# Altium project HIL_RIG_Hardware.PrjPcb (part 11 of 11)

## Sheet  Led_Green_Direct.SchDoc
size A4; SheetNumber: 4; SheetTotal: 29
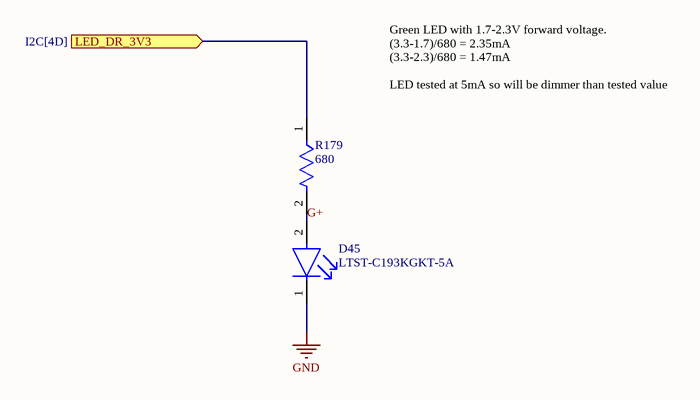
[diagram p28:  Led_Green_Direct.SchDoc]

### Parts
D45  LTST-C193KGKT-5A  [FP-LTST-C193KGKT-5A-MFG]
R179  value 680  [FP-CRCW0603-e3-IPC_C]  (hidden comment: CRCW0603680RJNEA)

### Ports
LED_DR_3V3 (in, see I2C[4D])

### Nets
GND: D45.1(C)
G+: D45.2(A) R179.2
NetR179_1: R179.1 ; port LED_DR_3V3

### Notes on the sheet
- Green LED with 1.7-2.3V forward voltage.
  (3.3-1.7)/680 = 2.35mA
  (3.3-2.3)/680 = 1.47mA
  LED tested at 5mA so will be dimmer than tested value

### Library data of the parts
D45 = CMP-007-00038-1: LED yellow green 0603 wavelength 567.5~576.5nm light intensity 4.5~28mcd Front Mounting; Luminous Intensity: 16.25mcd; Viewing Angle: 130°; Number of Circuits: 1; Power Dissipation: 50mW; Peak Wavelength: 574nm; Illumination Color: Green, Yellow; Lens Color: Clear, Colorless; Lens Style: Clear, Colorless, Diffused, Rectangular; Forward Voltage: 1.9V; Power Rating: 75mW; Reverse Voltage: 5V; Wavelength: 571nm; Shape: Rectangular; Lens Transparency: Clear; Test Current: 5mA; Forward Current: 30mA; Width: 800µm; Manufacturer Package Identifier: LTST-C193KGKT-5A; Dominant Wavelength: 576.5nm; Export Control Classification Number (ECCN) Code: EAR99; Color: Green; Lead Free: Lead Free; Introduction Date: 2007-03-15; RoHS: Compliant; Number of Elements: 1; Height: 350µm; Schedule B: 8541402000, 8541402000; Country of Origin: Mainland China, Thailand; Case Code (Imperial): 0603; Length: 1.6mm; Lifecycle Status: Production; China RoHS: Compliant; Min Operating Temperature: -55°C; Terminal Pitch: 1.5mm; Number of LEDs: 1; Number of Terminals: 2; Pins: 2; Case Code (Metric): 1608; Max Operating Temperature: 85°C; Harmonized Tariff Schedule (HTS) Code: 8541.40.20.00; Depth: 800µm; Mounting Technology: Surface Mount; Case/Package: 0603; REACH SVHC: Yes; Radiation Hardening: No
R179 = CMP-009-00300-1: as R149 on sheet  3V3_High_Current; Case/Package: 0603; Voltage Rating (DC): 75V; Lifecycle Status: Production; Depth: 850µm; Introduction Date: 2005-02-16; Number of Terminations: 2; Composition: Thick Film; Export Control Classification Number (ECCN) Code: EAR99; RoHS: Compliant; Packaging: Cut Tape; Max Power Dissipation: 100mW; Max Operating Temperature: 155°C; Harmonized Tariff Schedule (HTS) Code: 8533.21.00.30; Voltage Rating: 75V; China RoHS: Non-Compliant; Width: 850µm; Height: 450µm; Schedule B: 8533210045, 8533210045; Mounting Technology: Surface Mount; Pins: 2; Radiation Hardening: No; Features: Automotive AEC-Q200; Min Operating Temperature: -55°C; Lead Free: Lead Free; Working Voltage: 75V; Military Standard: Not; Tolerance: 5%; Case Code (Imperial): 0603; Number of Terminals: 2; Weight: 2.012816mg; REACH SVHC: Yes; Length: 1.55mm; Ratings: AEC-Q200; Contact Plating: Tin; Termination: SMD/SMT; Country of Origin: Israel, Taiwan

## Sheet  LED_Orange_Direct.SchDoc
size A4; SheetNumber: 10; SheetTotal: 29
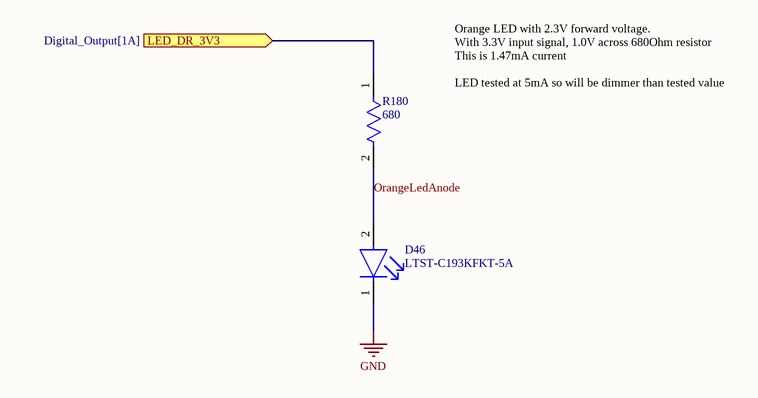
[diagram p29:  LED_Orange_Direct.SchDoc]

### Parts
D46  LTST-C193KFKT-5A  [FP-LTST-C193KGKT-5A-MFG]
R180  value 680  [FP-CRCW0603-e3-IPC_C]  (hidden comment: CRCW0603680RJNEA)

### Ports
LED_DR_3V3 (in, see Digital_Output[1A])

### Nets
GND: D46.1(C)
OrangeLedAnode: D46.2(A) R180.2
NetR180_1: R180.1 ; port LED_DR_3V3

### Notes on the sheet
- Orange LED with 2.3V forward voltage.
  With 3.3V input signal, 1.0V across 680Ohm resistor
  This is 1.47mA current
  LED tested at 5mA so will be dimmer than tested value

### Library data of the parts
D46 = CMP-007-00037-1: LED orange LED0603 wavelength 605nm light intensity 11~45mcd vertical sticker; Lens Color: Clear, Colorless; Number of LEDs: 1; Lens Transparency: Clear; Test Current: 5mA; Lens Style: Colorless, Diffused, Rectangular; Shape: Rectangular; Peak Wavelength: 611nm; Luminous Intensity: 28.1mcd; Forward Current: 30mA; Power Rating: 75mW; Illumination Color: Yellow; Viewing Angle: 130°; Forward Voltage: 2.3V; Reverse Voltage: 5V; Width: 800µm; Number of Circuits: 1; Case Code (Metric): 1608; Height: 350µm; Terminal Pitch: 1.5mm; Lifecycle Status: Production; Case/Package: 0603; Contact Plating: Tin; Number of Terminals: 2; Wavelength: 605nm; REACH SVHC: Yes; RoHS: Compliant; Introduction Date: 2010-10-11; Pins: 2; Packaging: Tape and Reel; Color: Orange; Radiation Hardening: No; Schedule B: 8541402000, 8541402000; Max Operating Temperature: 85°C; Number of Elements: 1; Length: 1.6mm; Power Dissipation: 75mW; Mounting Technology: Surface Mount; Harmonized Tariff Schedule (HTS) Code: 8541.40.20.00; Dominant Wavelength: 605nm; Case Code (Imperial): 0603; Depth: 800µm; China RoHS: Compliant; Min Operating Temperature: -30°C
R180 = CMP-009-00300-1: as R149 on sheet  3V3_High_Current; Case/Package: 0603; Voltage Rating (DC): 75V; Lifecycle Status: Production; Depth: 850µm; Introduction Date: 2005-02-16; Number of Terminations: 2; Composition: Thick Film; Export Control Classification Number (ECCN) Code: EAR99; RoHS: Compliant; Packaging: Cut Tape; Max Power Dissipation: 100mW; Max Operating Temperature: 155°C; Harmonized Tariff Schedule (HTS) Code: 8533.21.00.30; Voltage Rating: 75V; China RoHS: Non-Compliant; Width: 850µm; Height: 450µm; Schedule B: 8533210045, 8533210045; Mounting Technology: Surface Mount; Pins: 2; Radiation Hardening: No; Features: Automotive AEC-Q200; Min Operating Temperature: -55°C; Lead Free: Lead Free; Working Voltage: 75V; Military Standard: Not; Tolerance: 5%; Case Code (Imperial): 0603; Number of Terminals: 2; Weight: 2.012816mg; REACH SVHC: Yes; Length: 1.55mm; Ratings: AEC-Q200; Contact Plating: Tin; Termination: SMD/SMT; Country of Origin: Israel, Taiwan

## Sheet  LED_Green_Direct_ActiveLow.SchDoc
size A4; SheetNumber: 18; SheetTotal: 29
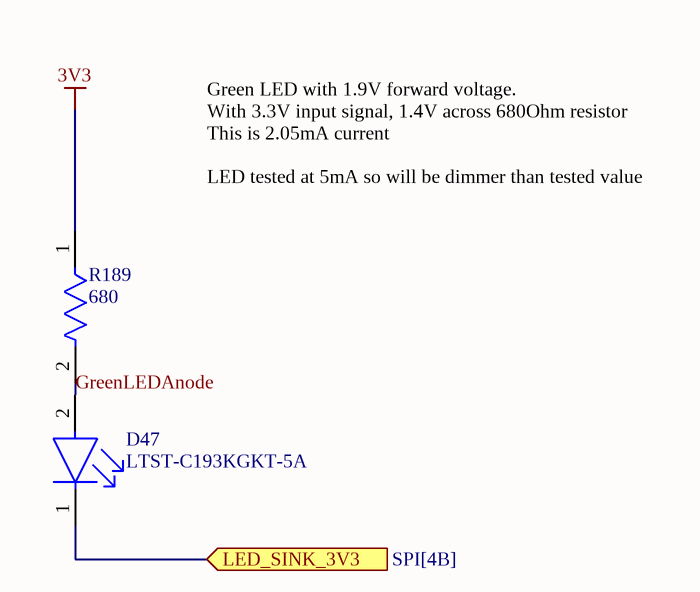
[diagram p30:  LED_Green_Direct_ActiveLow.SchDoc]

### Parts
D47  LTST-C193KGKT-5A  [FP-LTST-C193KGKT-5A-MFG]
R189  value 680  [FP-CRCW0603-e3-IPC_C]  (hidden comment: CRCW0603680RJNEA)

### Ports
LED_SINK_3V3 (in, see SPI[4B])

### Nets
3V3: R189.1
GreenLEDAnode: D47.2(A) R189.2
NetD47_1: D47.1(C) ; port LED_SINK_3V3

### Notes on the sheet
- Green LED with 1.9V forward voltage.
  With 3.3V input signal, 1.4V across 680Ohm resistor
  This is 2.05mA current
  LED tested at 5mA so will be dimmer than tested value

### Library data of the parts
D47 = CMP-007-00038-1: as D45 on sheet  Led_Green_Direct; Width: 800µm; Manufacturer Package Identifier: LTST-C193KGKT-5A; Dominant Wavelength: 576.5nm; Export Control Classification Number (ECCN) Code: EAR99; Color: Green; Lead Free: Lead Free; Introduction Date: 2007-03-15; RoHS: Compliant; Number of Elements: 1; Height: 350µm; Schedule B: 8541402000, 8541402000; Country of Origin: Mainland China, Thailand; Case Code (Imperial): 0603; Length: 1.6mm; Lifecycle Status: Production; China RoHS: Compliant; Min Operating Temperature: -55°C; Terminal Pitch: 1.5mm; Number of LEDs: 1; Number of Terminals: 2; Pins: 2; Case Code (Metric): 1608; Max Operating Temperature: 85°C; Harmonized Tariff Schedule (HTS) Code: 8541.40.20.00; Depth: 800µm; Mounting Technology: Surface Mount; Case/Package: 0603; REACH SVHC: Yes; Radiation Hardening: No
R189 = CMP-009-00300-1: as R149 on sheet  3V3_High_Current; Case/Package: 0603; Voltage Rating (DC): 75V; Lifecycle Status: Production; Depth: 850µm; Introduction Date: 2005-02-16; Number of Terminations: 2; Composition: Thick Film; Export Control Classification Number (ECCN) Code: EAR99; RoHS: Compliant; Packaging: Cut Tape; Max Power Dissipation: 100mW; Max Operating Temperature: 155°C; Harmonized Tariff Schedule (HTS) Code: 8533.21.00.30; Voltage Rating: 75V; China RoHS: Non-Compliant; Width: 850µm; Height: 450µm; Schedule B: 8533210045, 8533210045; Mounting Technology: Surface Mount; Pins: 2; Radiation Hardening: No; Features: Automotive AEC-Q200; Min Operating Temperature: -55°C; Lead Free: Lead Free; Working Voltage: 75V; Military Standard: Not; Tolerance: 5%; Case Code (Imperial): 0603; Number of Terminals: 2; Weight: 2.012816mg; REACH SVHC: Yes; Length: 1.55mm; Ratings: AEC-Q200; Contact Plating: Tin; Termination: SMD/SMT; Country of Origin: Israel, Taiwan

## Sheet  LED_RED_Direct_BRIGHT.SchDoc
size A4; SheetNumber: 5; SheetTotal: 29
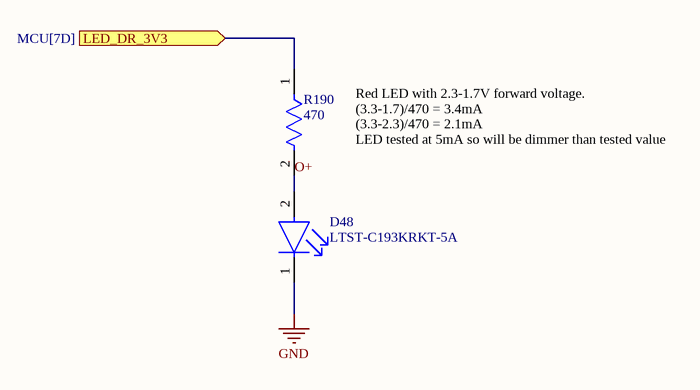
[diagram p31:  LED_RED_Direct_BRIGHT.SchDoc]

### Parts
D48  LTST-C193KRKT-5A  [FP-LTST-C193KRKT-5A-MFG]
R190  value 470  [FP-CRGCQ0603-IPC_A]  (hidden comment: CRGCQ0603J470R)

### Ports
LED_DR_3V3 (in, see MCU[7D])

### Nets
GND: D48.1(C)
O+: D48.2(A) R190.2
NetR190_1: R190.1 ; port LED_DR_3V3

### Notes on the sheet
- Red LED with 2.3-1.7V forward voltage.
  (3.3-1.7)/470 = 3.4mA
  (3.3-2.3)/470 = 2.1mA
  LED tested at 5mA so will be dimmer than tested value

### Library data of the parts
D48 = CMP-007-00039-1: Single-color LEDs; LITEON; LTST-C193KRKT-5A; Red; 130 °; 2.3 V; 0603; Viewing Angle: 130°; Lens Transparency: Clear; Test Current: 5mA; Power Dissipation: 50mW; Forward Voltage: 2.3V; Wavelength: 631nm; Lens Color: Clear, Colorless; Luminous Intensity: 26.05mcd; Number of LEDs: 1; Shape: Rectangular; Lens Style: Clear, Colorless, Diffused, Rectangular; Forward Current: 20mA; Reverse Voltage: 5V; Peak Wavelength: 639nm; RoHS: Compliant; Length: 1.6mm; Pins: 2; Lifecycle Status: Production; Harmonized Tariff Schedule (HTS) Code: 8541.40.20.00; Height: 350µm; Case Code (Imperial): 0603; Country of Origin: Mainland China, Thailand; Width: 800µm; Mounting Technology: Surface Mount; REACH SVHC: Yes; Lead Free: Lead Free; Export Control Classification Number (ECCN) Code: EAR99; Radiation Hardening: No; Case/Package: 0603; Depth: 800µm; Dominant Wavelength: 631nm; Illumination Color: Red; Min Operating Temperature: -30°C; Introduction Date: 2008-09-01; Number of Elements: 1; Number of Terminals: 2; Number of Circuits: 1; Schedule B: 8541402000, 8541402000; Case Code (Metric): 1608; Max Operating Temperature: 85°C; Color: Red; Terminal Pitch: 1.5mm; China RoHS: Compliant
R190 = CMP-009-00304-1: Res Thick Film 0603 470 Ohm 5% 0.1W(1/10W) ±100ppm/°C Pad SMD T/R Automotive AEC-Q200; Manufacturer Lifecycle Status: ACTIVE; Working Voltage: 75V; Power Rating: 100mW; RoHS: Compliant; Lifecycle Status: Production; Voltage Rating: 75V; Number of Terminals: 2; Packaging: Cut Tape; Width: 800µm; Height: 450µm; Min Operating Temperature: -55°C; Introduction Date: 2019-08-26; Ambient Temperature Range High: 70°C; Voltage Rating (DC): 75V; Max Operating Temperature: 155°C; China RoHS: Non-Compliant; Operating Supply Voltage: 75V; Schedule B: 8533210025, 8533210025; Tolerance: 5%; REACH SVHC: Yes; Ratings: AEC-Q200; Harmonized Tariff Schedule (HTS) Code: 8533.21.00.30; Mounting Technology: Surface Mount; Composition: Thick Film; Temperature Coefficient: 100ppm/°C; Case/Package: 0603; Export Control Classification Number (ECCN) Code: EAR99; Length: 1.6mm

## Sheet  LED_Blue_Direct_BRIGHT.SchDoc
size A4; SheetNumber: 6; SheetTotal: 29
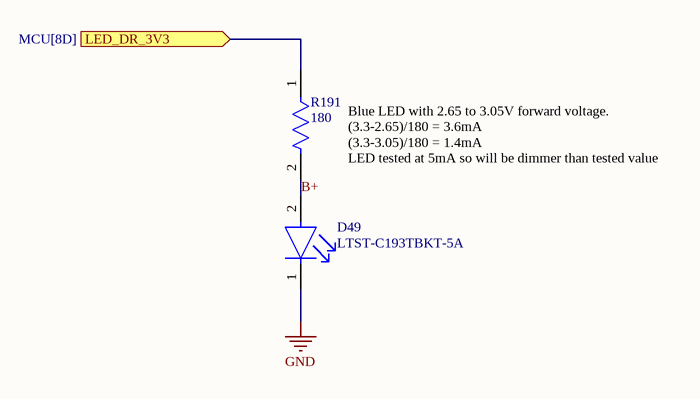
[diagram p32:  LED_Blue_Direct_BRIGHT.SchDoc]

### Parts
D49  LTST-C193TBKT-5A  [FP-LTST-C193TBKT-5A-MFG]
R191  value 180  [FP-RT0603-IPC_C]  (hidden comment: RT0603DRE07180RL)

### Ports
LED_DR_3V3 (in, see MCU[8D])

### Nets
GND: D49.1(C)
B+: D49.2(A) R191.2
NetR191_1: R191.1 ; port LED_DR_3V3

### Notes on the sheet
- Blue LED with 2.65 to 3.05V forward voltage.
  (3.3-2.65)/180 = 3.6mA
  (3.3-3.05)/180 = 1.4mA
  LED tested at 5mA so will be dimmer than tested value

### Library data of the parts
D49 = CMP-007-00045-1: LED blue 0603 wavelength 465~475nm light intensity 15mcd Front Mounting; Forward Current: 20mA; Viewing Angle: 130°; Lens Color: Clear, Colorless; Peak Wavelength: 468nm; Forward Voltage: 2.8V; Number of Elements: 1; Lens Style: Clear, Colorless, Diffused, Rectangular; Shape: Rectangular; Dominant Wavelength: 475nm; Test Current: 5mA; Wavelength: 470nm; Lens Transparency: Clear; Reverse Voltage: 5V; Power Dissipation: 76mW; Mounting Technology: Surface Mount; Lifecycle Status: Production; Pins: 2; Schedule B: 8541402000, 8541402000; RoHS: Compliant; REACH SVHC: Yes; Number of LEDs: 1; Width: 800µm; Luminous Intensity: 15mcd; Radiation Hardening: No; Case Code (Imperial): 0603; Length: 1.6mm; Case Code (Metric): 1608; Terminal Pitch: 1.5mm; Lead Free: Lead Free; Min Operating Temperature: -20°C; Color: Blue; Case/Package: 0603; Number of Terminals: 2; China RoHS: Compliant; Max Operating Temperature: 80°C; Contact Plating: Tin; Height: 350µm; Number of Circuits: 1; Illumination Color: Blue; Depth: 800µm
R191 = CMP-009-00324-1: Res Thin Film 0603 180 Ohm 0.5% 0.1W(1/10W) ±50ppm/C Pad SMD T/R; Power Rating: 100mW; Voltage Rating (DC): 50V; Voltage Rating: 75V; Temperature Coefficient: 50ppm/°C; Composition: Thin Film; Case/Package: 0603; Mounting Technology: Surface Mount; Harmonized Tariff Schedule (HTS) Code: 8533.21.00.30; REACH SVHC: Yes; Max Operating Temperature: 155°C; Tolerance: 0.5%; Min Operating Temperature: -55°C; Height: 450µm; RoHS: Compliant; Working Voltage: 75V; Number of Terminals: 2; China RoHS: Non-Compliant; Export Control Classification Number (ECCN) Code: EAR99; Introduction Date: 2008-07-11; Packaging: Tape & Reel (TR); Lifecycle Status: Production; Schedule B: 8533210045; Width: 800µm; Length: 1.6mm; Case Code (Imperial): 0603; Country of Origin: Mainland China, Taiwan; Features: Moisture Resistant; Lead Free: Lead Free; Max Power Dissipation: 100mW; Number of Terminations: 2

## Nets that join several sheets
3V3:  MCU (8 pins),  Digital_Input (C30.1 U3.9 U3.16),  Power (C37.2 U4.16),  Digital_Output (R32.2 R35.2 U6.12 U8.12),  PWM_Input (11 pins),  PWM_Output (5 pins),  CAN (C90.1 U28.3),  SPI (10 pins),  UART (11 pins),  External_Flash (6 pins),  3V3_High_Current (8 pins),  I2C (7 pins),  Output_Expander_IC (C177.1 R176.2 U54.9),  LED_Green_Direct_ActiveLow (R189.1)
5V:  Digital_Input (C28.1 D2.2 U2.3),  Power (7 pins),  Digital_Output (U6.14 U8.14),  PWM_Output (C60.2 C62.2 U16.1 U16.5),  Analogue_Output (C88.2 U25.13 U25.14),  UART (6 pins),  I2C (C26.1 C168.2 U50.1 U56.1)
12V:  Digital_Output (U6.15 U8.15),  PWM_Output (5 pins),  Analogue_Output (7 pins),  12V (10 pins)
24V:  Digital_Output (8 pins),  PWM_Output (D13.1 Q5.2 R49.2),  Analogue_Output (5 pins),  24V (10 pins)
GND:  MCU (43 pins),  PWM_CAPTURE_VREF (R185.2 R186.2 R187.2 R188.2),  Digital_Input (20 pins),  Power (28 pins),  Digital_Output (22 pins),  PWM_Input (18 pins),  PWM_Output (16 pins),  Analogue_Input (9 pins),  Analogue_Output (52 pins),  CAN (C90.2 C91.2 U28.2 U28.8),  SPI (8 pins),  UART (23 pins),  External_Flash (C87.2 C178.1 R77.2 U39.4),  Connectors (63 pins),  24V (24 pins),  12V (24 pins),  5V (25 pins),  3V3_Smooth (6 pins),  3V3_High_Current (8 pins),  I2C (25 pins),  Output_Expander_IC (C177.2 R177.1 R178.1 U54.10),  Led_Green_Direct (D45.1),  LED_Orange_Direct (D46.1),  LED_RED_Direct_BRIGHT (D48.1),  LED_Blue_Direct_BRIGHT (D49.1)
VDD:  MCU (35 pins),  PWM_CAPTURE_VREF (R181.1 R182.1 R183.1 R184.1),  Digital_Input (8 pins),  Analogue_Input (6 pins),  Connectors (5 pins),  24V (C124.2 U42.3),  12V (C140.2 U44.3),  5V (C156.2 U47.3)

## Assembly variants
 V01: not fitted ? ? ? ?
 JLCPCB Assembled Parts: not fitted ? ? ? ? ? ? ?